# Altium schematic sheet 12VOutIface.SchDoc
size A; SheetNumber: 5; SheetTotal: 5
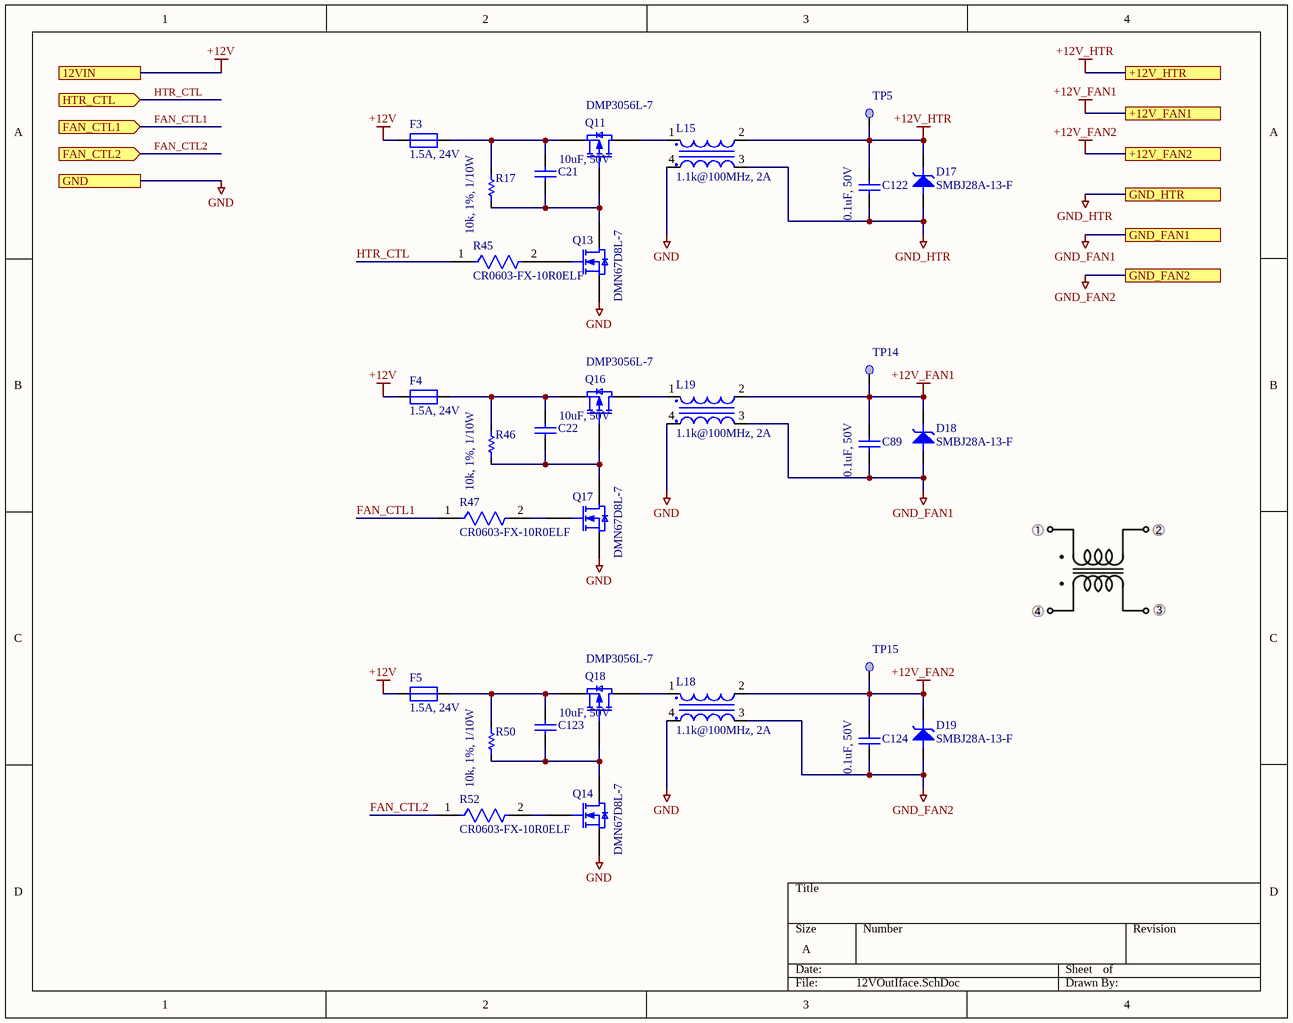
[diagram p0: 12VOutIface.SchDoc]

## Parts
C21  10uF, 50V  [1206]
C22  10uF, 50V  [1206]
C89  0.1uF, 50V  [0603]
C122  0.1uF, 50V  [0603]
C123  10uF, 50V  [1206]
C124  0.1uF, 50V  [0603]
D17  SMBJ28A-13-F  [SMB]
D18  SMBJ28A-13-F  [SMB]
D19  SMBJ28A-13-F  [SMB]
F3  1.5A, 24V  [1812_CAP]
F4  1.5A, 24V  [1812_CAP]
F5  1.5A, 24V  [1812_CAP]
L15  1.1k@100MHz, 2A  [PLCC440P435X370X235-4L]
L18  1.1k@100MHz, 2A  [PLCC440P435X370X235-4L]
L19  1.1k@100MHz, 2A  [PLCC440P435X370X235-4L]
Q11  DMP3056L-7  [SOT23-3]
Q13  DMN67D8L-7  [SOT23-3]
Q14  DMN67D8L-7  [SOT23-3]
Q16  DMP3056L-7  [SOT23-3]
Q17  DMN67D8L-7  [SOT23-3]
Q18  DMP3056L-7  [SOT23-3]
R17  10k, 1%, 1/10W  [0603]
R45  CR0603-FX-10R0ELF  [FP-CR0603-MFG]
R46  10k, 1%, 1/10W  [0603]
R47  CR0603-FX-10R0ELF  [FP-CR0603-MFG]
R50  10k, 1%, 1/10W  [0603]
R52  CR0603-FX-10R0ELF  [FP-CR0603-MFG]
TP5  Test Point  [TEST POINT 40 Mil]  (value not drawn)  (no BOM)
TP14  Test Point  [TEST POINT 40 Mil]  (value not drawn)  (no BOM)
TP15  Test Point  [TEST POINT 40 Mil]  (value not drawn)  (no BOM)

## Ports
12VIN, +12V_FAN1, +12V_FAN2, +12V_HTR, FAN_CTL1 (in), FAN_CTL2 (in), GND, GND_FAN1, GND_FAN2, GND_HTR, HTR_CTL (in)

## Nets
+12V: F3.2(K) F4.2(K) F5.2(K) ; port 12VIN
+12V_FAN1: C89.2 D18.2(K) L19.2 TP14.1 ; port +12V_FAN1
+12V_FAN2: C124.2 D19.2(K) L18.2 TP15.1 ; port +12V_FAN2
+12V_HTR: C122.2 D17.2(K) L15.2 TP5.1 ; port +12V_HTR
GND: L15.4 L18.4 L19.4 Q13.2(S) Q14.2(S) Q17.2(S) ; port GND
GND_FAN1: C89.1 D18.1(A) L19.3 ; port GND_FAN1
GND_FAN2: C124.1 D19.1(A) L18.3 ; port GND_FAN2
GND_HTR: C122.1 D17.1(A) L15.3 ; port GND_HTR
FAN_CTL1: R47.1 ; port FAN_CTL1
FAN_CTL2: R52.1 ; port FAN_CTL2
HTR_CTL: R45.1 ; port HTR_CTL
NetC21_1: C21.1 F3.1(A) Q11.2(S) R17.1
NetC21_2: C21.2 Q11.1(G) Q13.3(D) R17.2
NetC22_1: C22.1 F4.1(A) Q16.2(S) R46.1
NetC22_2: C22.2 Q16.1(G) Q17.3(D) R46.2
NetC123_1: C123.1 F5.1(A) Q18.2(S) R50.1
NetC123_2: C123.2 Q14.3(D) Q18.1(G) R50.2
NetL15_1: L15.1 Q11.3(D)
NetL18_1: L18.1 Q18.3(D)
NetL19_1: L19.1 Q16.3(D)
NetQ13_1: Q13.1(G) R45.2
NetQ14_1: Q14.1(G) R52.2
NetQ17_1: Q17.1(G) R47.2

## Library data of the parts
C21 C22 C123 = Cap: CAP CER 10UF 50V X7R 1206; Part Number: NS00832; Type: C; Alternatives: Generic; Value: 10uF, 50V; Supplier 1: Digi-Key; Supplier Part Number 1: 1276-6767-1-ND
C89 C122 C124 = Cap: CAP CER 0.1UF 50V X7R 0603; Part Number: NS00838; Type: C; Alternatives: Generic; Value: 0.1uF, 50V; Supplier 1: Digi-Key; Supplier Part Number 1: 1276-1935-1-ND
D17-D19 = DiodeZener: TVS DIODE 28VWM 45.4VC SMB; Part Number: NS00891; Type: Diode; Value: SMBJ28A-13-F; ComponentLink1Description: Datasheet; ComponentLink1URL: H:\Doc\Diodes\ds19002-2.pdf; Supplier 1: Digi-Key; Supplier Part Number 1: SMBJ28A-FDICT-ND
F3-F5 = Fuse: PTC RESET FUSE 24V 1.5A 1812; Part Number: NS00950; Alternatives: Generic; Type: Fuse; Value: 1.5A, 24V; Supplier 1: Digi-Key; Supplier Part Number 1: 507-1773-1-ND
L15 L18 L19 = CHOKE_COMMON_ALT: CMC 2A 2LN 1.1K OHM SMD; Part Number: NS00952; Type: Inductor; Value: 1.1k@100MHz, 2A; ComponentLink1Description: Datasheet; ComponentLink1URL: H:\Doc\Murata\EFLC0026.pdf; Supplier 1: Digi-Key; Supplier Part Number 1: 490-12641-1-ND
Q11 Q16 Q18 = FET_P_GSD: MOSFET P-CH 30V 4.3A SOT23; Part Number: NS00910; Type: IC; Value: DMP3056L-7; ComponentLink1Description: Datasheet; ComponentLink1URL: H:\Doc\Diodes\DMP3056L.pdf; Supplier 1: Digi-Key; Supplier Part Number 1: DMP3056L-7DICT-ND
Q13 Q14 Q17 = FET_N_GSD: MOSFET N-CH 60V 210MA SOT23; Part Number: NS00873; Type: IC; Published: 8-Jun-2000; LatestRevisionDate: 17-Jul-2002; LatestRevisionNote: Re-released for DXP Platform.; PackageVersion: 1995/1996; PackageReference: E3; Publisher: Altium Limited; Value: DMN67D8L-7; ComponentLink1Description: Datasheet; ComponentLink1URL: H:\Doc\Diodes\DMN67D8L.pdf; Supplier 1: Digi-Key; Supplier Part Number 1: DMN67D8L-7DICT-ND
R17 R46 R50 = RESISTOR: RES 10K OHM 1% 1/10W 0603; Part Number: NS00820; Alternatives: Generic; Type: R; Value: 10k, 1%, 1/10W; Supplier 1: Digi-Key; Supplier Part Number 1: RMCF0603FT10K0CT-ND
R45 R47 R52 = CMP-1012-00284-2: Thick Film Chip Resistors 0603 10Ω 0.1W 1% 100ppm/°C; Max Power Dissipation: 100mW; Resistance: 10R; Voltage Rating: 50V; Depth: 0.8mm; REACH SVHC: No SVHC; Package Quantity: 1; Thickness: 457um; Length: 1.6mm; Tolerance: 1%; Width: 0.8mm; Number of Pins: 2; Height: 0.45mm; Military Standard: Not; Features: Moisture Resistant; Packaging: Tape and Reel; Case/Package: 0603; Power Rating: 100mW; Voltage Rating (DC): 50V; Radiation Hardening: No; Mount: Surface Mount; Min Operating Temperature: -55°C; Composition: Thick Film; Max Operating Temperature: 155°C; Termination: SMD/SMT; Temperature Coefficient: 100ppm/°C; Case Code (Imperial): 0603; Case Code (Metric): 1608; Number of Terminations: 2; Contact Plating: Tin
TP5 TP14 TP15 = Test Point: Test Point 0.3mm; PartType: Mechanical; ComponentLink1Description: Datasheet